# Altium schematic sheet DC_Converter.SchDoc
size A
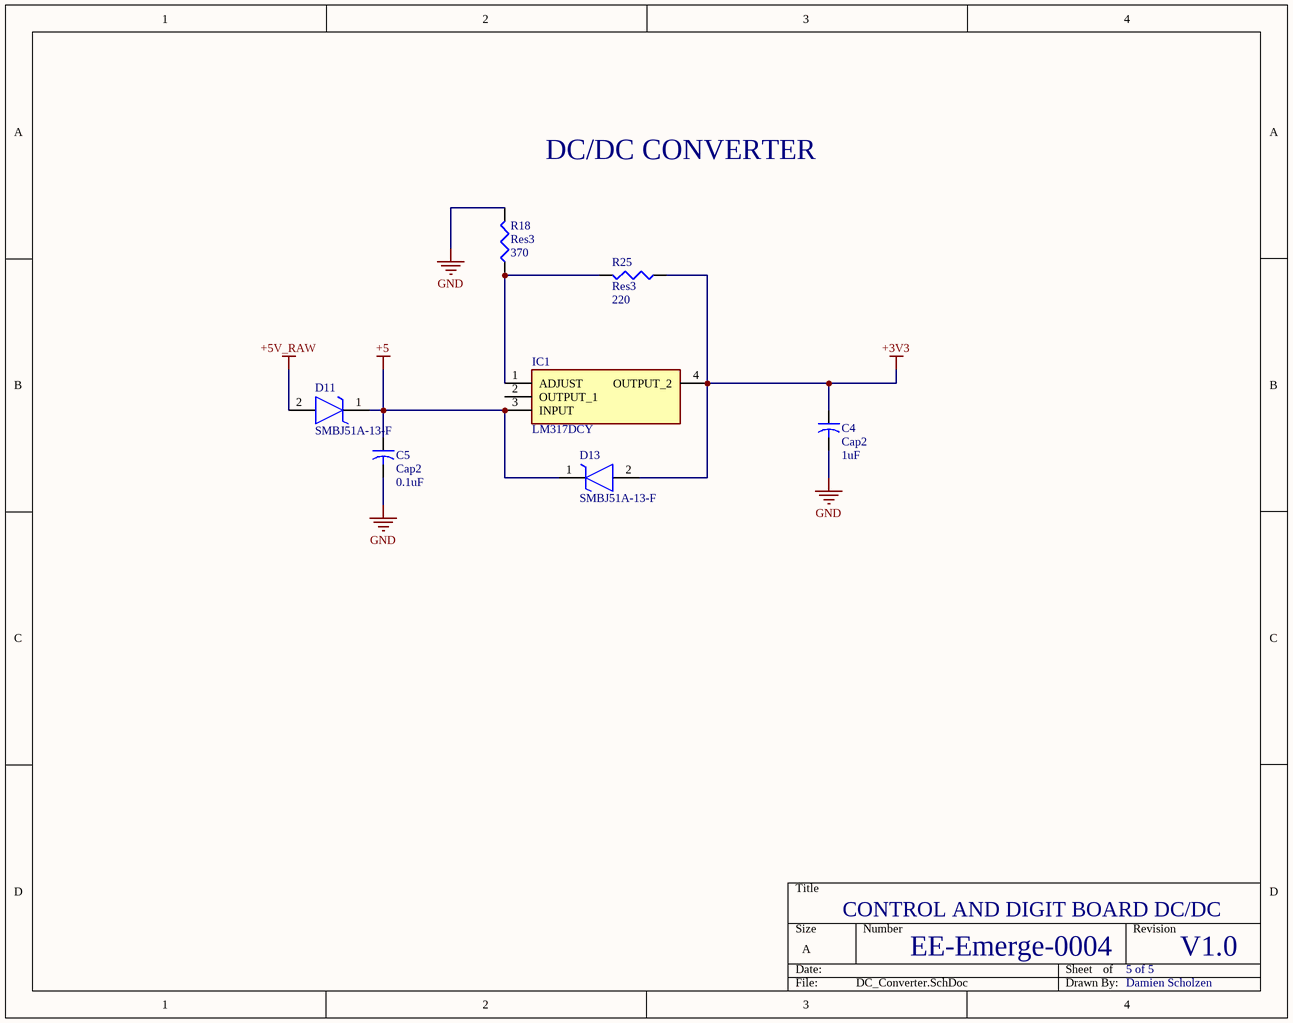
[diagram p0: DC_Converter.SchDoc]

## Parts
C4  Cap2  value 1uF  [C0805]
C5  Cap2  value 0.1uF  [C0805]
D11  SMBJ51A-13-F  [DIOM5336X250N]
D13  SMBJ51A-13-F  [DIOM5336X250N]
IC1  LM317DCY  [SOT230P700X180-4N]
R18  Res3  value 370  [J1-0603]
R25  Res3  value 220  [J1-0603]

## Nets
+3V3: C4.1 D13.2(A) IC1.4(OUTPUT_2) R25.1
+5: C5.1 D11.1(K) D13.1(K) IC1.3(INPUT)
+5V_RAW: D11.2(A)
GND: C4.2 C5.2 R18.2
NetIC1_1: IC1.1(ADJUST) R18.1 R25.2

Not connected (* = marked no-connect by the designer): IC1 2(OUTPUT_1)

## Notes on the sheet
- DC/DC CONVERTER
- CONTROL AND DIGIT BOARD DC/DC
- EE-Emerge-0004
- 5 of 5
- V1.0
- Damien Scholzen

## Library data of the parts
C4 = Cap2_1: Capacitor; Published: 23-Sep-2002; PackageReference: CAPR5-4X5; Publisher: Altium Limited; PackageDescription: Capacitor; 2 Leads
C5 = Cap2_2: Capacitor; Published: 23-Sep-2002; PackageReference: CAPR5-4X5; Publisher: Altium Limited; PackageDescription: Capacitor; 2 Leads
D11 D13 = SMBJ51A-13-F: TVS Diode (Uni-directional); Manufacturer_Name: Diodes Inc.; Datasheet Link: https://componentsearchengine.com/Datasheets/1/SMBJ51A-13-F.pdf; Height: 2.5mm; Manufacturer_Part_Number: SMBJ51A-13-F; Mouser Part Number: 621-SMBJ51A-13-F; Mouser Price/Stock: https://www.mouser.co.uk/ProductDetail/Diodes-Incorporated/SMBJ51A-13-F?qs=gaDBXWSqsDAVAEhlXLJJrA%3D%3D; Arrow Part Number: SMBJ51A-13-F; Arrow Price/Stock: https://www.arrow.com/en/products/smbj51a-13-f/diodes-incorporated
IC1 = LM317DCY: Integrated Circuit; Manufacturer_Name: Texas Instruments; Datasheet Link: http://www.ti.com/lit/ds/symlink/lm317.pdf; Height: 1.8mm; Manufacturer_Part_Number: LM317DCY; Mouser Part Number: 595-LM317DCY; Mouser Price/Stock: https://www.mouser.co.uk/ProductDetail/Texas-Instruments/LM317DCY?qs=5BZzbFV4k2uyLTpaIDoA2Q%3D%3D; Arrow Part Number: LM317DCY; Arrow Price/Stock: https://www.arrow.com/en/products/lm317dcy/texas-instruments?region=nac
R18 R25 = Res3: Resistor; Published: 8-Jun-2000; LatestRevisionDate: 29-May-2009; LatestRevisionNote: IPC-7351 Footprint Added.; PackageReference: J1-0603; Publisher: Altium Limited; PackageDescription: Chip Resistor